# EAGLE design RH023.3 (EAGLE 7.1.0)
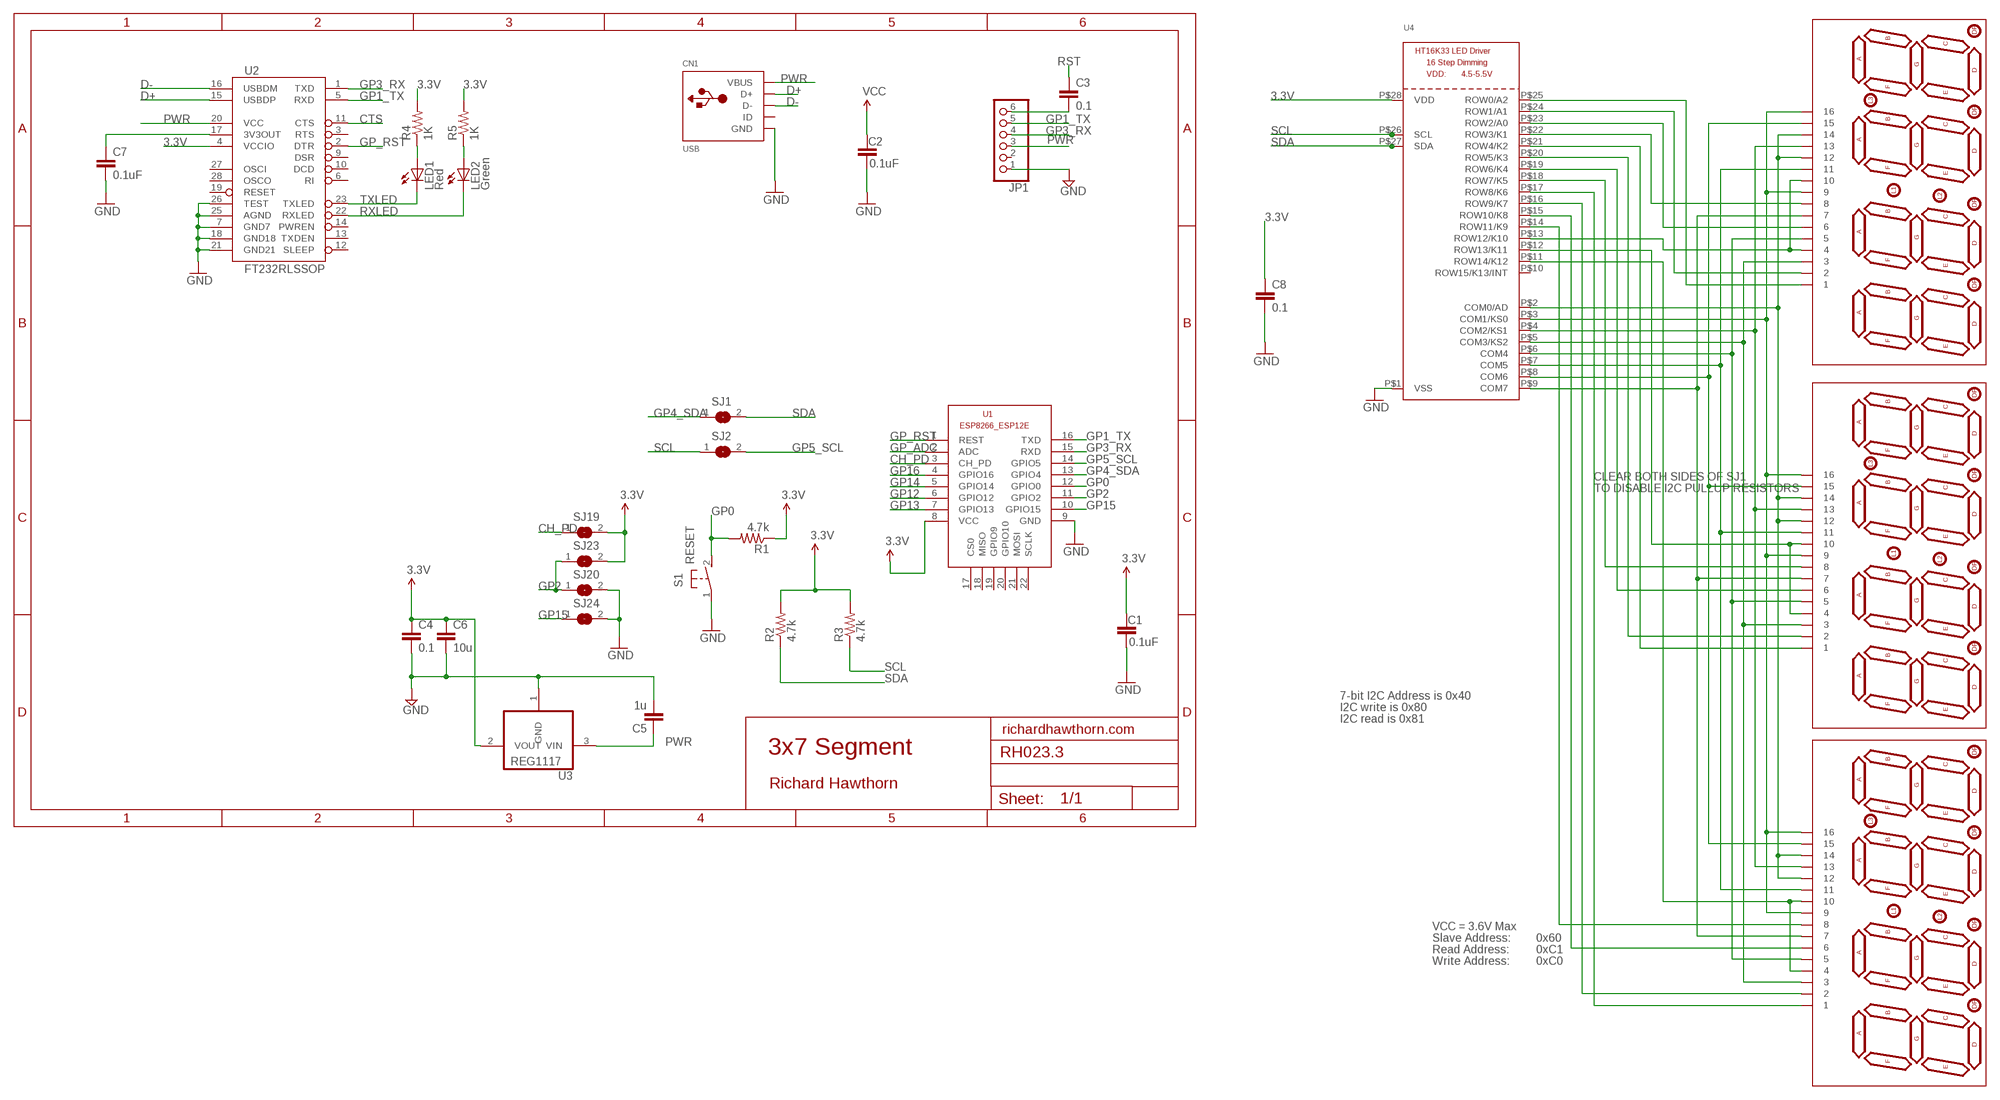
[diagram p0: schematic, sheet 1]

## Parts
C1  0.1uF  0.1UF-25V(+80/-20%)(0603)  [0603-CAP]
C2  0.1uF  0.1UF-25V(+80/-20%)(0603)  [0603-CAP]
C3  0.1  CAP0603-CAP  [0603-CAP]
C4  0.1  CAP0603-CAP  [0603-CAP]
C5  1u  CAP0603-CAP  [0603-CAP]
C6  10u  CAP0805-CAP  [0805-CAP]
C7  0.1uF  CAP0402-CAP  [0402-CAP]
C8  0.1  CAP0603-CAP  [0603-CAP]
CN1  USB  USBMINIB  [USB-MINIB]
JP1  PINHD-1X6  [1X06]
LED1  Red  LED0603  [LED-0603]
LED2  Green  LED0603  [LED-0603]
LED3  7SEG-4DIGIT  [SPARKFUN_7-SEGMENT-4DIGIT]
LED4  7SEG-4DIGIT  [SPARKFUN_7-SEGMENT-4DIGIT]
LED5  7SEG-4DIGIT  [SPARKFUN_7-SEGMENT-4DIGIT]
R1  4.7k  RESISTOR0805-RES  [0805]
R2  4.7k  RESISTOR0805-RES  [0805]
R3  4.7k  RESISTOR0805-RES  [0805]
R4  1K  RESISTOR0402-RES  [0402-RES]
R5  1K  RESISTOR0402-RES  [0402-RES]
S1  RESET  DTSM-3  [DTSM-3]
SJ1  SJ  [SJ]
SJ2  SJ  [SJ]
SJ19  SJ  [SJ]
SJ20  SJ  [SJ]
SJ23  SJ  [SJ]
SJ24  SJ  [SJ]
U1  ESP8266-12EESP8266-ESP12E  [ESP8266-ESP12E]
U2  FT232RLSSOP  [SSOP28DB]
U3  REG1117  [SOT223]
U4  HT16K33_SOP28  [SOP28_300MIL]

## Nets
3.3V: C1.1 C2.1 C4.1 C6.1 C8.1 R1.1 R2.2 R3.2 R4.2 R5.2 SJ19.2 SJ23.2 U1.8(VCC) U2.4(VCCIO) U3.2(VOUT) U4.P$28(VDD) ; supply symbol labelled VCC
3.3VOUT: C7.1 U2.17(3V3OUT)
CH_PD: SJ19.1 U1.3(CH_PD)
CTS: U2.11(CTS)
D+: CN1.D+ U2.15(USBDP)
D-: CN1.D- U2.16(USBDM)
GND [power]: C1.2 C2.2 C4.2 C5.2 C6.2 C7.2 C8.2 CN1.GND JP1.1 S1.1 SJ20.2 SJ24.2 U1.9(GND) U2.7(GND7) U2.18(GND18) U2.21(GND21) U2.25(AGND) U2.26(TEST) U3.1(GND) U4.P$1(VSS)
GP0: R1.2 S1.2 U1.12(GPIO0)
GP1_TX: JP1.5 U1.16(TXD) U2.5(RXD)
GP2: SJ20.1 SJ23.1 U1.11(GPIO2)
GP3_RX: JP1.4 U1.15(RXD) U2.1(TXD)
GP4_SDA: SJ1.1 U1.13(GPIO4)
GP5_SCL: SJ2.2 U1.14(GPIO5)
GP12: U1.6(GPIO12)
GP13: U1.7(GPIO13)
GP14: U1.5(GPIO14)
GP15: SJ24.1 U1.10(GPIO15)
GP16: U1.4(GPIO16)
GP_ADC: U1.2(ADC)
GP_RST: U1.1(REST) U2.2(DTR)
N$1: LED3.12 LED3.14 LED4.12 LED4.14 LED5.12 LED5.14 U4.P$2(COM0/AD)
N$2: LED1.A R4.1
N$3: LED2.A R5.1
N$4: LED3.9 LED3.16 LED4.9 LED4.16 LED5.9 LED5.16 U4.P$3(COM1/KS0)
N$5: LED3.13 LED4.13 LED5.13 U4.P$4(COM2/KS1)
N$6: LED3.3 LED4.3 LED5.3 U4.P$5(COM3/KS2)
N$7: LED3.5 LED4.5 LED5.5 U4.P$6(COM4)
N$8: LED3.11 LED4.11 LED5.11 U4.P$7(COM5)
N$9: LED3.15 LED4.15 LED5.15 U4.P$8(COM6)
N$10: LED3.7 LED4.7 LED5.7 U4.P$9(COM7)
N$11: LED3.1 U4.P$25(ROW0/A2)
N$12: LED3.2 U4.P$24(ROW1/A1)
N$13: LED3.6 U4.P$23(ROW2/A0)
N$14: LED3.8 U4.P$22(ROW3/K1)
N$15: LED4.1 U4.P$21(ROW4/K2)
N$16: LED4.2 U4.P$20(ROW5/K3)
N$17: LED4.6 U4.P$19(ROW6/K4)
N$18: LED4.8 U4.P$18(ROW7/K5)
N$19: LED5.1 U4.P$17(ROW8/K6)
N$20: C3.2 JP1.6
N$21: LED5.2 U4.P$16(ROW9/K7)
N$22: LED5.6 U4.P$15(ROW10/K8)
N$23: LED5.8 U4.P$14(ROW11/K9)
N$24: LED3.4 LED3.10 U4.P$13(ROW12/K10)
N$25: LED4.4 LED4.10 U4.P$12(ROW13/K11)
N$26: LED5.4 LED5.10 U4.P$11(ROW14/K12)
PWR [power]: C5.1 CN1.VBUS JP1.3 U2.20(VCC) U3.3(VIN)
RST: C3.1
RXLED: LED2.C U2.22(RXLED)
SCL: R3.1 SJ2.1 U4.P$26(SCL)
SDA: R2.1 SJ1.2 U4.P$27(SDA)
TXLED: LED1.C U2.23(TXLED)
Unconnected: CN1.ID JP1.2 U1.17(CS0) U1.18(MISO) U1.19(GPIO9) U1.20(GPIO10) U1.21(MOSI) U1.22(SCLK) U2.3(RTS) U2.6(RI) U2.9(DSR) U2.10(DCD) U2.12(SLEEP) U2.13(TXDEN) U2.14(PWREN) U2.19(RESET) U2.27(OSCI) U2.28(OSCO) U4.P$10(ROW15/K13/INT)

## Notes on the sheet
- CLEAR BOTH SIDES OF SJ1
- TO DISABLE I2C PULLUP RESISTORS
- 7-bit I2C Address is 0x40
- I2C write is 0x80
- I2C read is 0x81
- richardhawthorn.com
- 3x7 Segment
- Richard Hawthorn
- VCC = 3.6V Max
- Slave Address: | 0x60
- Read Address: | 0xC1
- Write Address: | 0xC0

## Library data of the parts
C1 C2 = SparkFun-Capacitors:0.1UF-25V(+80/-20%)(0603): Ceramic Standard decoupling cap CAP-00810; PROD_ID: CAP-00810
C3-C6 C8 = LowPowerLab:CAP: Capacitor Standard 0603 ceramic capacitor, and 0.1" leaded capacitor.
C7 = SparkFun:CAP: Capacitor Standard 0603 ceramic capacitor, and 0.1" leaded capacitor.
CN1 = LowPowerLab:USB: USB Connectors USBMINIB - Surface Mount Female Mini-B USB Connector 4UConnector: 06564 By microbuilder.eu Thru-hole RA Female Mini-B USB Connector 4UConnector: 18732 By ladyada.net
JP1 = Richards:PINHD-1X6: PIN HEADER
LED1 LED2 = SparkFun:LED: LEDs Standard schematic elements and footprints for 5mm, 3mm, 1206, and 0603 sized LEDs. 5mm - Spark Fun Electronics SKU : COM-00529 (and others)
LED3-LED5 = sparkfun-4digit-sseg:7SEG-4DIGIT
R1-R5 = SparkFun:RESISTOR: Resistor Basic schematic elements and footprints for 0603, 1206, and PTH resistors.
S1 = switch-tact:DTSM-3
SJ1 SJ2 SJ19 SJ20 SJ23 SJ24 = jumper:SJ: SMD solder JUMPER
U1 = ESP8266-ESP12E:ESP8266-12E: ESP8266-12E with additional I/O and GPIO04/05 corrected The author cannot warrant that this library is free from error or will meet your specific requirements. Created by PuceBaboon.com. Komagane, Nagano, JAPAN
U2 = SparkFun:FT232RL: USB UART FT232RL 4th Generation USB UART (USB <-> Serial) Controller. Spark Fun Electronics SKU : COM-00650
U3 = burr-brown:REG1117: 800mA and 1A Low Dropout (LDO) Positive Regulator 1.8V, 2.5V, 2.85V, 3.3V, 5V, and Adj; MPN: REG1117; OC_FARNELL: 1097566; OC_NEWARK: 14P6981
U4 = microbuilder:HT16K33_SOP28

## Net classes
1 power: width 0.381 mm, clearance 0.254 mm

## Board
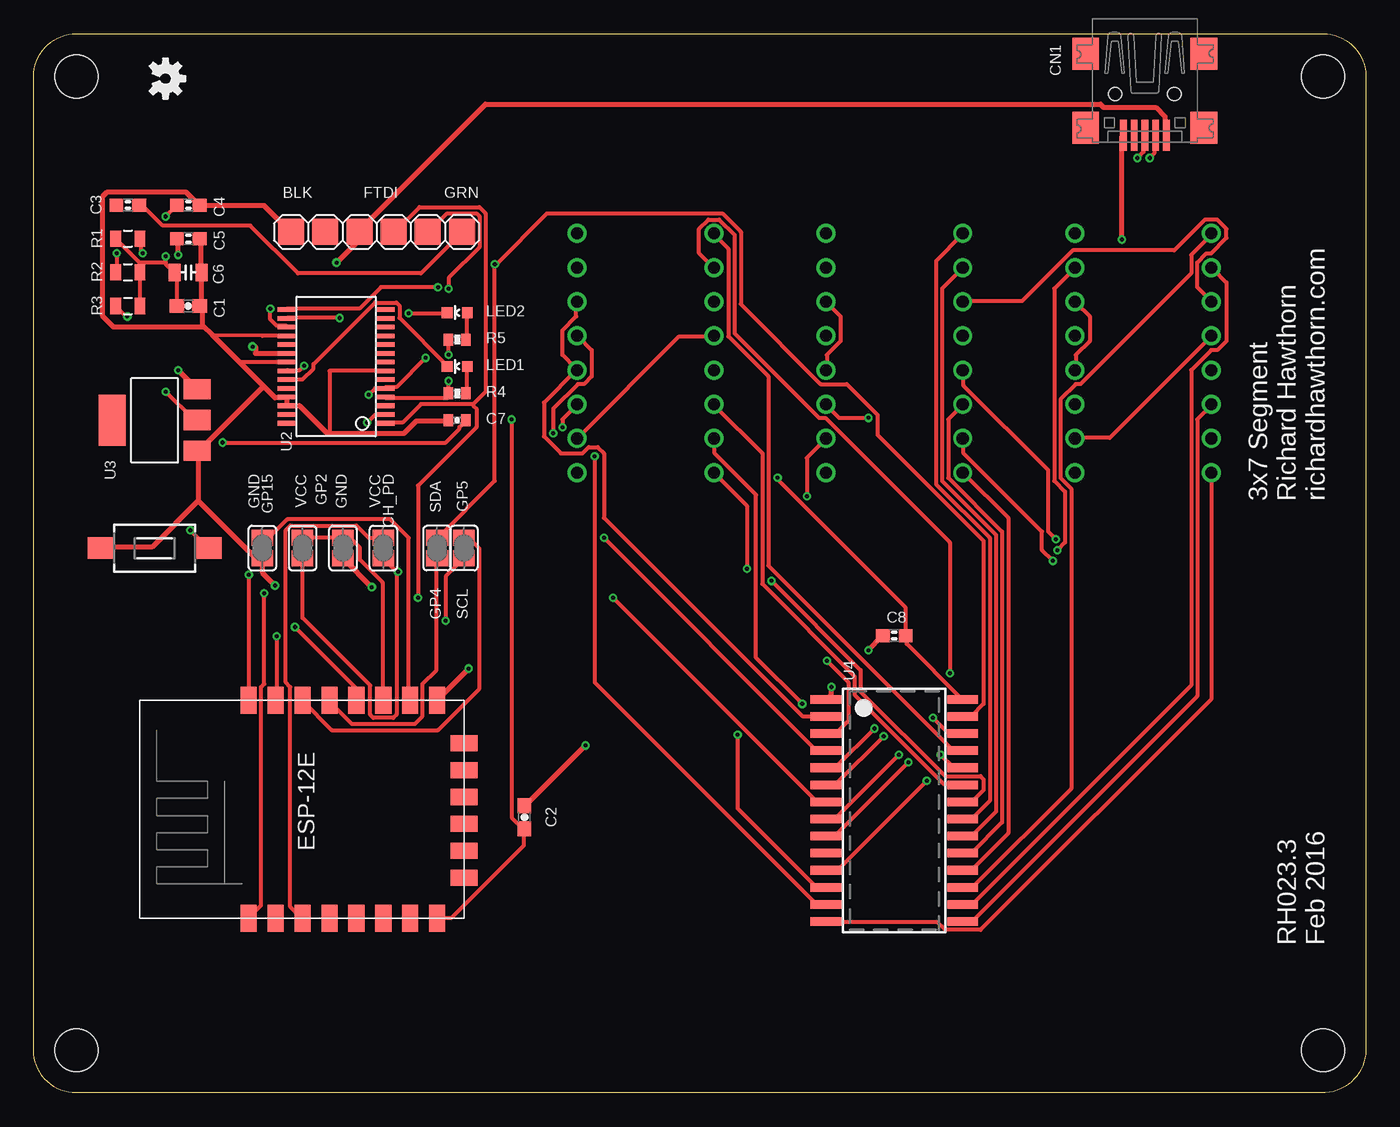
[diagram p1: board, top side]
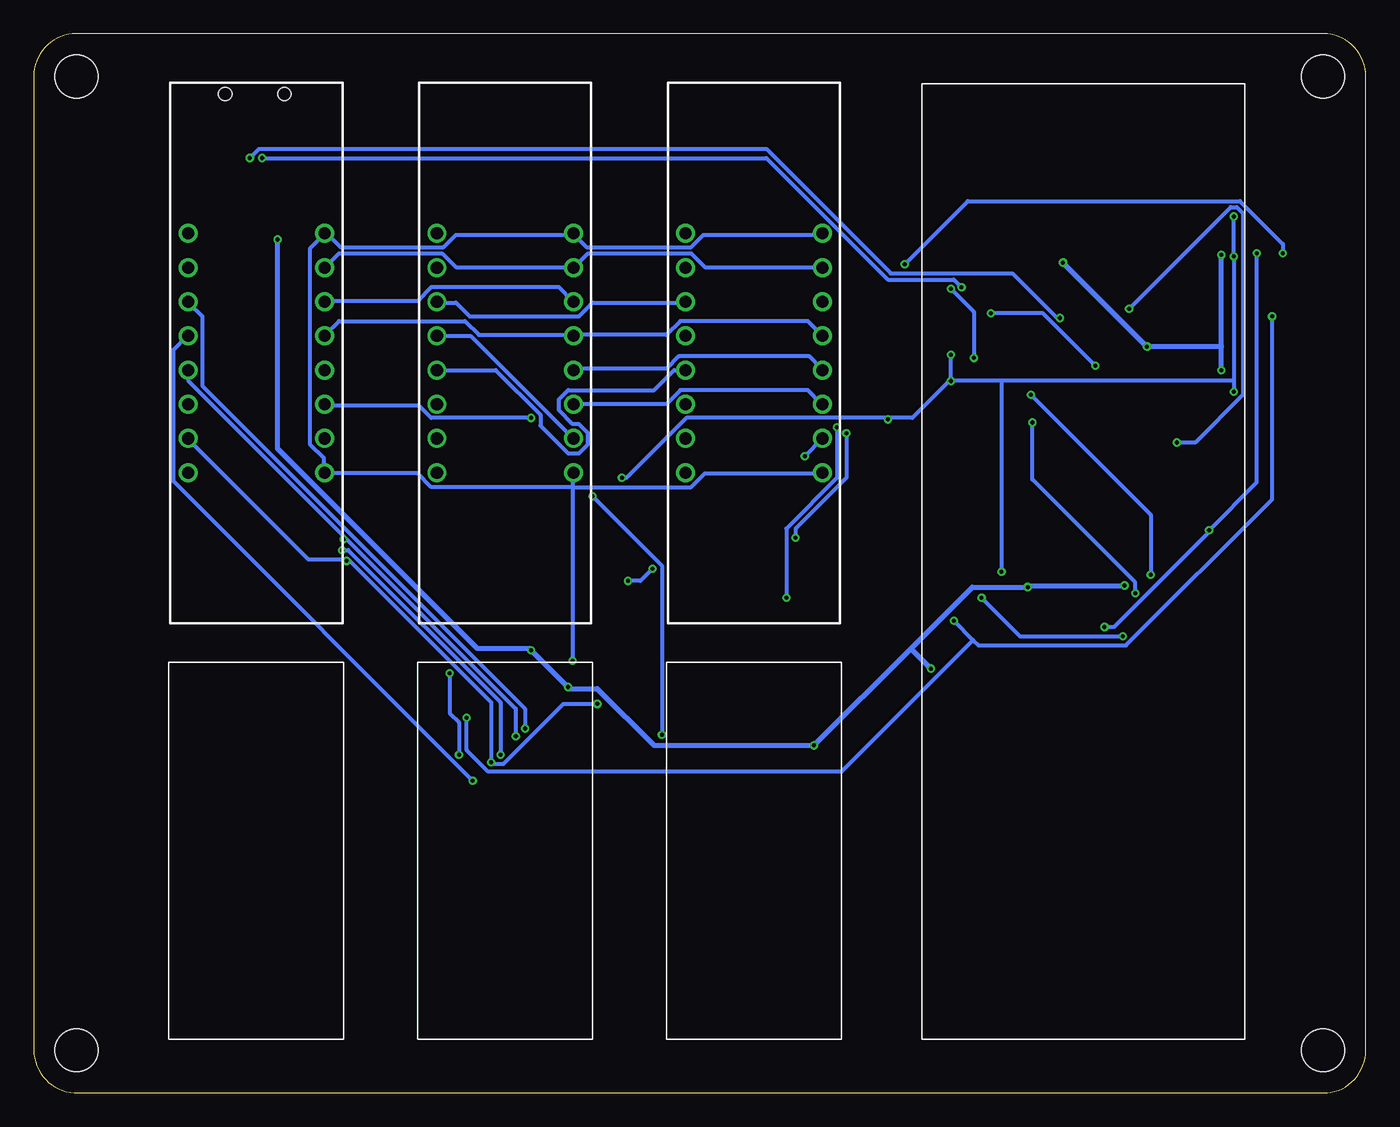
[diagram p2: board, bottom side, seen from below]

Size 99.06 x 78.74 mm. Coordinates in mm from the lower left corner, seen from the top.
Outline: 0,3.17 0,75.56 arc-90 3.17,78.74 95.89,78.74 arc-90 99.06,75.56 99.06,3.17 arc-90 95.76,0 3.17,0 arc-90 0,3.17
Copper layers (1*16): Top 0.035mm / dielectric 1.5mm / Bottom 0.035mm
Design rules "ITEADstudio_DRC *": minimum track width 12mil, minimum drill 12mil, track to track 6mil, track to pad 6mil, pad to pad 6mil, via to via 6mil, smd to smd 0mil, copper to edge 10mil, drill to drill 10mil, minimum pad ring 10mil, minimum via ring 6mil, stop-mask expansion 2mil, vias tented up to drill 100mil, thermal gap 15mil
Holes 3.2 mm at 3.17,3.17 95.89,3.17 3.17,75.56 95.89,75.56
tRestrict: area 0,0 to 15.5,33.5
bRestrict: area 0,0 to 15.5,33.5

### Footprints (pad centres in the part's own frame; a part is rotated, then mirrored left to right if it is on the bottom)
0603-CAP = smd 1.1 x 1: 1 -0.85,0; 2 0.85,0
0603-CAP' = smd 1.016 x 0.965: 1 -0.85,0; 2 0.85,0
0805-CAP = smd 0.902 x 1.3: 1 -1,0; 2 1,0
0402-CAP = smd 0.7 x 0.9: 1 -0.65,0; 2 0.65,0
USB-MINIB = smd 0.5 x 2.308: D+ 0,4.064; D- -0.8,4.064; GND 1.6,4.064; ID 0.8,4.064; VBUS -1.6,4.064 | smd 2 x 2.4: GND1 -4.4,-2; GND2 -4.4,3.5; GND3 4.4,3.5; GND4 4.4,-2 | hole 1: -2.2,1; 2.2,1
1X06 = smd 1.93 x 1.93: 1 -6.35,0; 2 -3.81,0; 3 -1.27,0; 4 1.27,0; 5 3.81,0; 6 6.35,0
LED-0603 = smd 0.8 x 0.8: A 0,-0.75; C 0,0.75
SPARKFUN_7-SEGMENT-4DIGIT = drill 0.9: 1 -8.89,-5.08; 2 -6.35,-5.08; 3 -3.81,-5.08; 4 -1.27,-5.08; 5 1.27,-5.08; 6 3.81,-5.08; 7 6.35,-5.08; 8 8.89,-5.08; 9 8.89,5.08; 10 6.35,5.08; 11 3.81,5.08; 12 1.27,5.08; 13 -1.27,5.08; 14 -3.81,5.08; 15 -6.35,5.08; 16 -8.89,5.08
0805 = smd 0.8 x 1.2: 1 -0.9,0; 2 0.9,0
0402-RES = smd 0.7 x 0.9: 1 -0.65,0; 2 0.65,0
DTSM-3 = smd 2 x 1.6: 1 -3.97,0; 2 3.97,0
SJ = smd 1.168 x 1.6: 1 -0.762,0; 2 0.762,0
ESP8266-ESP12E = smd 2 x 1.2: 1 0,16; 2 0,14; 3 0,12; 4 0,10; 5 0,8; 6 0,6; 7 0,4; 8 0,2; 9 16.2,2; 10 16.2,4; 11 16.2,6; 12 16.2,8; 13 16.2,10; 14 16.2,12; 15 16.2,14; 16 16.2,16 | smd 1.2 x 2: 17 11,0; 18 3,0; 19 5,0; 20 13,0; 21 7,0; 22 9,0
SSOP28DB = smd 0.348 x 1.397: 1 -4.225,-3.656; 2 -3.575,-3.656; 3 -2.925,-3.656; 4 -2.275,-3.656; 5 -1.625,-3.656; 6 -0.975,-3.656; 7 -0.325,-3.656; 8 0.325,-3.656; 9 0.975,-3.656; 10 1.625,-3.656; 11 2.275,-3.656; 12 2.925,-3.656; 13 3.575,-3.656; 14 4.225,-3.656; 15 4.225,3.656; 16 3.575,3.656; 17 2.925,3.656; 18 2.275,3.656; 19 1.625,3.656; 20 0.975,3.656; 21 0.325,3.656; 22 -0.325,3.656; 23 -0.975,3.656; 24 -1.625,3.656; 25 -2.275,3.656; 26 -2.925,3.656; 27 -3.575,3.656; 28 -4.225,3.656
SOT223 = smd 1.499 x 2.007: 1 -2.261,-3.15; 2 0.025,-3.15; 3 2.311,-3.15 | smd 3.81 x 2.007: 4 0,3.15
SOP28_300MIL = smd 0.635 x 2.286: P$1 -8.255,-5.08; P$2 -6.985,-5.08; P$3 -5.715,-5.08; P$4 -4.445,-5.08; P$5 -3.175,-5.08; P$6 -1.905,-5.08; P$7 -0.635,-5.08; P$8 0.635,-5.08; P$9 1.905,-5.08; P$10 3.175,-5.08; P$11 4.445,-5.08; P$12 5.715,-5.08; P$13 6.985,-5.08; P$14 8.255,-5.08; P$15 8.255,5.08; P$16 6.985,5.08; P$17 5.715,5.08; P$18 4.445,5.08; P$19 3.175,5.08; P$20 1.905,5.08; P$21 0.635,5.08; P$22 -0.635,5.08; P$23 -1.905,5.08; P$24 -3.175,5.08; P$25 -4.445,5.08; P$26 -5.715,5.08; P$27 -6.985,5.08; P$28 -8.255,5.08

### Placement (x,y rotation side)
C1  11.5,58.5 0 top
C2  36.5,20.5 90 top
C3  0.1  [0603-CAP']  7,66 0 top
C4  0.1  [0603-CAP']  11.5,66 0 top
C5  1u  [0603-CAP']  11.5,63.5 0 top
C6  11.5,61 0 top
C7  31.5,50 180 top
C8  0.1  [0603-CAP']  64,34 180 top
CN1  82.62,75.25 180 top
JP1  25.5,64 0 top
LED1  31.5,54 90 top
LED2  31.5,58 90 top
LED3  45.5,55 270 bottom
LED4  64,55 270 bottom
LED5  82.5,55 270 bottom
R1  7,63.5 0 top
R2  7,61 0 top
R3  7,58.5 0 top
R4  31.5,52 180 top
R5  31.5,56 180 top
S1  9,40.5 0 top
SJ1  30,40.5 90 top
SJ2  32,40.5 90 top
SJ19  26,40.5 270 top
SJ20  23,40.5 270 top
SJ23  20,40.5 270 top
SJ24  17,40.5 270 top
U1  32,13 90 top
U2  22.5,54 90 top
U3  9,50 90 top
U4  64,21 270 top
U$3  [OSHW-LOGO-S]  9.8,75.4 270 top

### Tracks (layer width: path | path; a pad name or v marks a point on that pad's centre or on a via)
3.3V  (via drill 0.3)
  Top 0.305: 26.98,38.75 26.98,28.12 26.75,27.89 25.26,27.89 25.03,28.12 25.03,30.29 20,35.32 20,39.66 SJ23.2 | 26.98,38.75 26.06,39.66 SJ19.2 | U1.8 30.06,13.03 31.09,13.03 36.46,18.4 36.46,19.55 C2.1 36.35,19.66 35.55,20.46 v35.55,50.06 | U4.P$28 69.04,29.26 64.92,33.38 64.92,33.95 C8.1 64.81,34.06 64.81,36.12 55.32,45.61 v55.32,45.72 | U2.4 26.18,51.66 30.75,51.66 R4.2 30.86,52.12 v30.86,52.92 | v30.86,54.86 30.86,55.89 R5.2 | R3.2 7.89,58.52 7.89,60.92 R2.2 7.89,61.15 7.89,61.72 | 7.89,61.72 6.17,63.44 R1.1 | v9.83,65.15 10.63,65.95 C4.1 | 9.83,61.72 9.83,61.61 10.4,61.04 C6.1 10.63,60.92 10.63,58.52 C1.1 | 9.83,61.72 v9.83,62.18 | v9.83,52.12 11.89,50.06 12.12,50.06 U3.2 | 9.83,61.72 7.89,61.72 | v27.09,38.75 26.98,38.75
  Bottom 0.305: v30.86,52.92 v30.86,54.86 | v9.83,65.15 v9.83,62.18 9.83,52.92 | 9.83,52.92 v9.83,52.12 | 9.83,52.92 27.09,52.92 | 27.09,52.92 v30.86,52.92 | v55.32,45.72 54.98,45.72 50.52,50.18 35.55,50.18 | 35.55,50.18 33.72,50.18 30.98,52.92 v30.86,52.92 | v35.55,50.06 35.55,50.18 | 27.09,52.92 v27.09,38.75
3.3VOUT  (via drill 0.3)
  Top 0.305: v14.06,48.35 30.63,48.35 31.66,49.38 31.66,49.49 32.12,49.95 C7.1 | v17.6,58.29 17.6,57.49 18.06,57.04 18.75,57.04 U2.17
  Bottom 0.305: v14.06,48.35 12.69,48.35 9.14,51.89 9.14,65.38 9.6,65.84 10.06,65.84 v17.6,58.29
CH_PD
  Top 0.305: SJ19.1 25.95,41.26 24.92,41.26 24,42.18 19.09,42.18 18.75,41.83 18.75,30.52 19.09,30.18 19.09,13.83 19.89,13.03 U1.3
D+  (via drill 0.3)
  Top 0.305: v30.06,59.89 25.83,59.89 24.23,58.29 18.86,58.29 U2.15 | v82.07,69.49 82.53,69.95 82.53,71.09 CN1.D+
  Bottom 0.305: v30.06,59.89 30.63,60.47 35.55,60.47 44.58,69.49 v82.07,69.49
D-  (via drill 0.3)
  Top 0.305: v22.75,57.61 18.86,57.61 U2.16 | v82.98,69.49 83.33,69.84 83.33,71.09 CN1.D-
  Bottom 0.305: v22.75,57.61 22.97,57.61 26.29,60.92 35.32,60.92 44.58,70.18 82.3,70.18 v82.98,69.49
GND  (via drill 0.3)
  Top 0.305: U2.7 22,53.67 22,49.03 | U2.21 15.5,54.33 15.3,54.3 | 17,56.27 U2.18 13.3,56.3
  Top 0.381: 12.23,44.01 16.46,39.78 16.92,39.78 SJ24.2 17.03,39.55 17.03,38.63 v17.95,37.72 | 12.23,44.01 12.23,47.66 U3.1 12.34,47.78 17.09,52.52 | 12.23,44.01 8.8,40.58 5.14,40.58 S1.1 | JP1.1 19.09,64.01 17.14,65.95 12.46,65.95 C4.2 12.23,66.06 11.32,66.98 5.49,66.98 5.14,66.64 5.14,57.72 5.94,56.92 12.46,56.92 12.57,57.04 | C5.2 12.46,63.44 12.46,61.04 C6.2 12.46,60.81 12.46,58.52 C1.2 12.57,58.41 12.57,57.04 | C7.2 30.75,49.95 28.46,49.95 27.55,49.03 22,49.03 21.83,49.03 19.77,51.09 18.86,51.09 U2.26 18.86,51.21 18.86,51.66 U2.25 18.75,51.66 17.95,51.66 17.09,52.52 | 17.09,52.52 15.3,54.3 13.3,56.3 12.57,57.04 | v62.06,32.92 63.09,33.95 C8.2 | v59.32,30.18 59.32,29.6 58.98,29.26 U4.P$1 | v41.03,25.83 36.58,21.37 C2.2 | v25.15,37.6 23.09,39.66 SJ20.2 | v32.35,31.55 30.06,29.26 U1.9 | v80.92,63.44 80.92,71.09 CN1.GND
  Bottom 0.381: 33.83,33.03 v41.03,25.83 52.92,25.83 57.15,30.06 59.21,30.06 v59.32,30.18 v62.06,32.92 62.18,33.03 66.06,33.03 80.92,47.89 v80.92,63.44 | 33.83,33.03 29.26,37.6 v25.15,37.6 25.03,37.72 v17.95,37.72 | 33.83,33.03 v32.35,31.55
GP0  (via drill 0.3)
  Top 0.305: v8.12,62.41 8,62.52 8,63.44 R1.2 | v11.66,41.83 12.92,40.58 S1.2 | v19.43,34.63 23.89,30.18 23.89,29.26 U1.12
  Bottom 0.305: v8.12,62.41 8.12,45.38 v11.66,41.83 11.66,41.72 18.75,34.63 v19.43,34.63
GP1_TX  (via drill 0.3)
  Top 0.305: v29.15,54.63 26.98,52.46 26.18,52.46 U2.5 26.06,52.35 25.38,52.35 v24.92,51.89 | v30.86,59.78 30.86,60.58 33.15,62.87 33.15,65.15 32.92,65.38 30.75,65.38 29.38,64.01 JP1.5 | v16,38.52 16,29.26 U1.16
  Bottom 0.305: v29.15,54.63 29.15,58.06 v30.86,59.78 | v16,38.52 16,42.98 v24.92,51.89
GP2
  Top 0.305: SJ23.1 22.97,41.26 SJ20.1 23.09,41.15 23.66,41.15 24.23,40.58 24.23,39.66 25.95,37.95 25.95,29.26 U1.11
GP3_RX  (via drill 0.3)
  Top 0.305: 32.69,51.21 28.8,51.21 27.43,49.84 26.18,49.84 U2.1 | 32.69,51.21 33.6,52.12 33.6,65.38 33.15,65.84 28.69,65.84 26.86,64.01 JP1.4 | v18.06,33.95 18.06,29.26 U1.15 | v28.57,36.8 28.57,45.15 32.92,49.49 32.92,50.86 32.69,51.09 32.69,51.21
  Bottom 0.305: v18.06,33.95 25.72,33.95 v28.57,36.8
GP4_SDA
  Top 0.305: SJ1.1 29.95,39.66 29.95,31.43 28.92,30.4 28.92,28 28.35,27.43 23.66,27.43 21.95,29.15 U1.13
GP5_SCL
  Top 0.305: SJ2.2 32,41.15 32.46,41.15 33.15,40.46 33.15,30.06 30.06,26.98 22.17,26.98 20,29.15 U1.14
GP15
  Top 0.305: SJ24.1 17.03,41.26 17.49,41.26 18.86,42.63 26.52,42.63 27.89,41.26 27.89,29.26 U1.10
GP_RST  (via drill 0.3)
  Top 0.305: v24.8,49.84 25.38,50.41 26.06,50.41 U2.2 | v17.14,37.15 17.14,30.4 16.92,30.18 16.92,13.95 16,13.03 U1.1
  Bottom 0.305: v24.8,49.84 24.8,45.61 17.14,37.95 v17.14,37.15
N$1
  Top 0.305: LED5.12 77.5,53.84 77.5,54.86 78.52,55.89 78.52,57.72 77.5,58.75 LED5.14 | LED4.12 58.98,53.84 58.98,54.86 60.01,55.89 60.01,57.72 58.98,58.75 LED4.14 | U4.P$2 58.86,28 57.15,28 42.41,42.75 42.41,47.55 41.95,48.01 41.26,48.01 40.8,47.55 39.2,47.55 37.95,48.81 37.95,51.32 40.35,53.72 LED3.12 40.35,53.84 39.32,54.86 39.32,56.69 40.35,57.72 40.35,58.75 LED3.14
  Bottom 0.305: LED4.12 58.86,53.84 52.01,53.84 51.09,54.75 41.38,54.75 40.46,53.84 LED3.12 | LED5.14 77.38,58.86 70.52,58.86 69.49,59.89 60.01,59.89 58.98,58.86 LED4.14
N$2
  Top 0.305: LED1.A 32.23,53.95 32.23,52.01 R4.1
N$3
  Top 0.305: LED2.A 32.23,57.95 32.23,56.01 R5.1
N$4  (via drill 0.3)
  Top 0.305: v58.98,32.12 60.58,30.52 60.58,27.66 59.66,26.75 58.98,26.75 U4.P$3
  Bottom 0.305: LED3.16 40.46,63.78 49.26,63.78 50.18,62.87 57.95,62.87 58.86,63.78 LED4.16 58.98,63.78 67.67,63.78 68.58,62.87 76.24,62.87 77.27,63.89 LED5.16 77.5,63.78 78.52,62.75 78.52,48.23 77.5,47.21 77.5,46.18 LED5.9 77.27,46.06 70.52,46.06 69.49,45.03 58.98,45.03 | 58.98,45.03 58.98,46.06 LED4.9 | 58.98,45.03 v58.98,32.12 | 58.98,45.03 50.18,45.03 49.15,46.06 40.46,46.06 LED3.9
N$5  (via drill 0.3)
  Top 0.305: v42.41,41.26 58.18,25.49 58.86,25.49 U4.P$4 | v38.63,49.03 38.63,50.86 40.46,52.69 40.92,52.69 41.49,53.26 41.49,55.21 40.46,56.24 LED3.13
  Bottom 0.305: LED5.13 77.38,56.35 76.35,57.38 66.98,57.38 65.95,56.35 58.98,56.35 LED4.13 58.86,56.35 52.01,56.35 50.98,57.38 41.49,57.38 40.46,56.35 LED3.13 | v42.41,41.26 42.41,41.95 38.63,45.72 v38.63,49.03
N$6  (via drill 0.3)
  Top 0.305: v62.52,27.09 59.66,24.23 58.98,24.23 U4.P$5 | LED4.3 69.15,58.86 73.5,58.86 77.27,62.64 84.81,62.64 87.1,64.92 88.01,64.92 88.7,64.24 88.7,63.55 87.55,62.41 87.21,62.41 86.53,61.72 86.53,59.89 87.55,58.86 LED5.3
  Bottom 0.305: LED3.3 50.63,58.75 57.49,58.75 58.52,57.72 66.64,57.72 67.67,58.75 69.04,58.75 LED4.3 | v62.52,27.09 62.52,28.57 86.53,52.58 86.53,57.72 87.55,58.75 LED5.3
N$7  (via drill 0.3)
  Top 0.305: v63.21,26.52 59.66,22.97 58.98,22.97 U4.P$6 | v76.01,41.15 75.44,41.72 75.44,46.29 69.15,52.58 69.15,53.72 LED4.5
  Bottom 0.305: LED3.5 50.63,53.72 51.44,53.72 52.92,52.23 59.32,52.23 60.01,51.55 60.01,50.75 58.98,49.72 58.52,49.72 57.84,49.03 57.84,48.23 58.52,47.55 59.32,47.55 61.38,49.61 61.38,50.41 64.69,53.72 69.04,53.72 LED4.5 | v63.21,26.52 63.21,28.57 75.84,41.2 | 75.84,41.2 87.55,52.92 87.55,53.72 LED5.5 | v76.01,41.15 75.89,41.15 75.84,41.2
N$8  (via drill 0.3)
  Top 0.305: v43.09,36.8 58.18,21.72 58.86,21.72 U4.P$7 | v39.32,49.49 39.32,50.06 40.35,51.09 LED3.11 | v62.06,50.18 59.89,50.18 58.98,51.09 LED4.11
  Bottom 0.305: v43.09,36.8 43.09,41.95 39.32,45.72 v39.32,49.49 | LED4.11 58.86,51.21 52.01,51.21 50.98,52.23 41.49,52.23 40.46,51.21 LED3.11 | v62.06,50.18 69.49,50.18 70.41,51.09 77.38,51.09 LED5.11
N$9  (via drill 0.3)
  Top 0.305: v64.35,25.15 59.66,20.46 58.98,20.46 U4.P$8 | v76.12,40.35 76.69,40.92 76.69,44.69 75.89,45.49 75.89,59.78 77.38,61.27 LED5.15
  Bottom 0.305: LED3.15 40.46,61.38 49.15,61.38 50.18,62.41 57.84,62.41 58.86,61.38 LED4.15 58.98,61.38 67.67,61.38 68.69,62.41 76.35,62.41 77.38,61.38 LED5.15 | v64.35,25.15 64.35,29.03 75.67,40.35 v76.12,40.35
N$10  (via drill 0.3)
  Top 0.305: v65.04,24.57 59.66,19.2 58.98,19.2 U4.P$9 | v57.15,28.92 53.72,32.35 53.72,44.46 50.63,47.55 50.63,48.58 LED3.7 | v75.78,39.55 74.98,40.35 74.98,41.72 69.15,47.55 69.15,48.58 LED4.7
  Bottom 0.305: 75.78,39.66 78.64,39.66 87.55,48.58 LED5.7 | 75.78,39.66 75.67,39.66 65.04,29.03 v65.04,24.57 65.04,24.46 64.12,24.46 59.66,28.92 v57.15,28.92 | v75.78,39.55 75.78,39.66
N$11
  Top 0.305: U4.P$25 69.04,25.49 68.35,25.49 54.63,39.2 54.63,53.26 51.66,56.24 51.66,62.75 50.63,63.78 LED3.1
N$12  (via drill 0.3)
  Top 0.305: v67.44,25.15 68.35,24.23 69.04,24.23 U4.P$24 | v68.12,31.2 68.12,40.92 58.86,50.18 58.41,50.18 52.12,56.46 52.12,63.78 50.98,64.92 50.18,64.92 49.49,64.24 49.49,62.41 50.52,61.38 LED3.2
  Bottom 0.305: v67.44,25.15 67.44,27.55 68.12,28.23 v68.12,31.2
N$13
  Top 0.305: U4.P$23 69.04,22.97 67.67,22.97 61.04,29.6 61.04,30.98 54.18,37.83 54.18,47.55 50.63,51.09 LED3.6
N$14  (via drill 0.3)
  Top 0.305: v54.86,38.06 61.49,31.43 61.49,29.83 67.78,23.55 70.41,23.55 70.64,23.32 70.64,22.52 69.84,21.72 69.15,21.72 U4.P$22 | v53.03,38.98 53.03,43.66 50.63,46.06 LED3.8
  Bottom 0.305: v54.86,38.06 53.95,38.06 v53.03,38.98
N$15
  Top 0.305: U4.P$21 69.15,20.46 69.84,20.46 71.09,21.72 71.09,41.26 67.09,45.26 67.09,61.84 69.04,63.78 LED4.1
N$16
  Top 0.305: U4.P$20 69.15,19.2 69.84,19.2 71.55,20.92 71.55,41.49 67.55,45.49 67.55,59.78 69.04,61.27 LED4.2
N$17
  Top 0.305: U4.P$19 69.15,17.83 69.72,17.83 72.01,20.12 72.01,41.72 68.01,45.72 68.01,50.06 69.04,51.09 LED4.6
N$18
  Top 0.305: U4.P$18 69.15,16.57 69.72,16.57 72.47,19.32 72.47,42.75 69.15,46.06 LED4.8
N$19
  Top 0.305: U4.P$17 69.15,15.32 69.84,15.32 77.15,22.63 77.15,44.92 76.35,45.72 76.35,51.55 77.5,52.69 77.84,52.69 86.07,60.92 86.07,62.29 87.55,63.78 LED5.1
N$20
  Top 0.305: C3.2 7.89,65.95 8.12,65.95 9.6,64.47 16.12,64.47 19.66,60.92 28.8,60.92 31.77,63.89 JP1.6
N$21
  Top 0.305: U4.P$16 69.15,14.06 69.84,14.06 86.07,30.29 86.07,53.72 87.55,55.21 88.01,55.21 88.7,55.89 88.7,60.24 87.67,61.27 LED5.2
N$22
  Top 0.305: U4.P$15 69.15,12.8 69.84,12.8 86.53,29.49 86.53,50.06 87.55,51.09 LED5.6
N$23
  Top 0.305: U4.P$14 58.98,12.69 67.21,12.69 67.78,12.12 70.41,12.12 87.55,29.26 87.55,46.06 LED5.8
N$24  (via drill 0.3)
  Top 0.305: v41.72,47.32 41.72,30.52 58.18,14.06 58.86,14.06 U4.P$13 | LED3.4 50.52,56.24 48.01,56.24 40.46,48.69 LED3.10
  Bottom 0.305: v41.72,47.32 40.46,48.58 LED3.10
N$25  (via drill 0.3)
  Top 0.305: v52.35,26.63 52.35,21.14 58.18,15.32 58.86,15.32 U4.P$12 | v57.49,44.35 57.49,47.21 58.86,48.58 LED4.10
  Bottom 0.305: v52.35,26.63 52.35,39.2 v57.49,44.35 | LED4.4 69.04,56.24 66.52,56.24 58.98,48.69 LED4.10
N$26  (via drill 0.3)
  Top 0.305: v66.41,23.2 59.78,16.57 58.98,16.57 U4.P$11 | LED5.10 77.5,48.69 80.01,48.69 87.55,56.24 LED5.4
  Bottom 0.305: v66.41,23.2 88.7,45.49 88.7,55.21 87.67,56.24 LED5.4
PWR  (via drill 0.3)
  Top 0.381: v10.74,62.29 10.74,63.44 C5.1 | v10.74,53.72 12.12,52.35 U3.3 | v16.27,55.48 16.5,55.48 16.5,54.98 18.75,54.98 U2.20 | v22.52,61.72 24.12,63.32 24.12,63.89 JP1.3 24.23,64.12 33.6,73.5 79.32,73.5 79.55,73.27 83.44,73.27 84.12,72.58 84.12,71.21 CN1.VBUS
  Bottom 0.381: v10.74,53.72 10.74,55.48 | 10.74,55.48 v10.74,62.29 | 10.74,55.48 v16.27,55.48 v22.52,61.72
RXLED  (via drill 0.3)
  Top 0.305: v27.89,57.95 30.75,57.95 LED2.C | v20.12,54.06 19.77,53.72 18.86,53.72 U2.22
  Bottom 0.305: v27.89,57.95 24,57.95 v20.12,54.06
SCL  (via drill 0.3)
  Top 0.305: v6.97,57.72 6.86,57.72 6.17,58.41 R3.1 | v30.63,35.09 30.63,38.41 31.89,39.66 SJ2.1 | v66.86,27.89 68.01,26.75 69.04,26.75 U4.P$26
  Bottom 0.305: v6.97,57.72 6.97,44.12 17.83,33.26 28.8,33.26 29.2,33.66 | v30.63,35.09 29.2,33.66 | v66.86,27.89 66.86,25.49 65.27,23.89 38.98,23.89 29.2,33.66
SDA  (via drill 0.3)
  Top 0.305: v6.17,62.41 6.17,61.04 R2.1 | SJ1.2 30.06,41.26 34.29,45.49 v34.29,61.61 34.4,61.61 38.18,65.38 51.21,65.38 52.58,64.01 52.58,58.64 58.52,52.69 60.47,52.69 62.75,50.41 62.75,48.92 70.64,41.03 70.64,28.92 69.72,28 69.15,28 U4.P$27
  Bottom 0.305: v6.17,62.41 6.17,63.09 9.37,66.29 29.6,66.29 v34.29,61.61
TXLED
  Top 0.305: LED1.C 30.75,54.06 27.2,57.61 27.2,58.52 26.98,58.75 25.38,58.75 20.8,54.18 20.8,53.84 20,53.03 18.86,53.03 U2.23

### Text on the board
tNames: BLK | FTDI | GRN | GND | GP15 | VCC | GP2 | GND | VCC | CH_PD | SDA | GP5 | 3x7 Segment / Richard Hawthorn / richardhawthorn.com | GP4 | SCL | RH023.3 / Feb 2016
tDocu: REG